# Altium schematic sheet AMU-S12-V00-PROFET.SchDoc
size A3; DocumentNumber: 12; SheetNumber: 12; SheetTotal: 12; Version: 00; Project: ####; PageSetup: Record=PageOptions|CenterHorizontal=True|CenterVertical=True|PrintScale=0.97|XCorrection=1.00|YCorrection=1.00|PrintKind=0|BorderSize=5000000|LeftOffset=0|BottomOffset=0|Orientation=2|PaperLength=1000|PaperWidth=1000|Scale=100|PaperSource=7|PrintQuality=-4|MediaType=1|DitherType=10|PaperKind=A4|PrintScaleMode=1
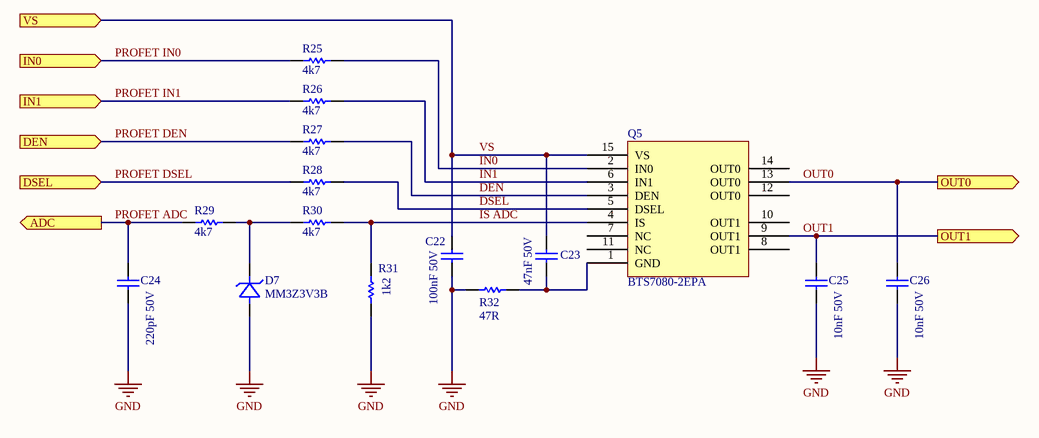
[diagram p0: AMU-S12-V00-PROFET.SchDoc]

## Parts
C22  100nF 50V  [Cap_Ceramic_0603]
C23  47nF 50V  [Cap_Ceramic_0603]
C24  220pF 50V  [Cap_Ceramic_0603]
C25  10nF 50V  [Cap_Ceramic_0603]
C26  10nF 50V  [Cap_Ceramic_0603]
D7  MM3Z3V3B  [SOD-323F]
Q5  BTS7080-2EPA  [BTS7008-2EPZ]
R25  4k7  [Res_ThinFilm_0603]
R26  4k7  [Res_ThinFilm_0603]
R27  4k7  [Res_ThinFilm_0603]
R28  4k7  [Res_ThinFilm_0603]
R29  4k7  [Res_ThinFilm_0603]
R30  4k7  [Res_ThinFilm_0603]
R31  1k2  [Res_ThinFilm_0603]
R32  47R  [Res_ThinFilm_0603]

## Ports
ADC (out), DEN (in), DSEL (in), IN0 (in), IN1 (in), OUT0 (out), OUT1 (out), VS (in)

## Nets
GND: C22.1 C24.1 C25.2 C26.2 D7.1(Anode) R31.1 R32.1
DEN: Q5.3(DEN) R27.2
DSEL: Q5.5(DSEL) R28.2
IN0: Q5.2(IN0) R25.2
IN1: Q5.6(IN1) R26.2
IS ADC: Q5.4(IS) R30.2 R31.2
OUT0: C26.1 Q5.13(OUT0) ; port OUT0
OUT1: C25.1 Q5.9(OUT1) ; port OUT1
PROFET ADC: C24.2 R29.1 ; port ADC
PROFET DEN: R27.1 ; port DEN
PROFET DSEL: R28.1 ; port DSEL
PROFET IN0: R25.1 ; port IN0
PROFET IN1: R26.1 ; port IN1
VS: C22.2 C23.2 Q5.15(VS) ; port VS
NetC23_1: C23.1 Q5.1(GND) R32.2
NetD7_2: D7.2(Cathode) R29.2 R30.1

Not connected (* = marked no-connect by the designer): Q5 7(NC) 8(OUT1) 10(OUT1) 11(NC) 12(OUT0) 14(OUT0)

## Notes on the sheet
- Revision History:
- Sheet Title:
- Rev
- Date
- Description
- Project:
- Size:
- Drawn By:
- A3
- Number:
- Revision:
- Sheet
- Version:
- of
- QUT Motorsport
- O-120, Gardens Point
- 2 George Street
- Brisbane, QLD 4000
- Australia
- Print Date:
- Print Time:
- File Name:

## Library data of the parts
C22 = 100nF 50V 5% X7R 0603: Capacitor, Ceramic, SMD, 100nF, 50V, 5%, X7R, 0603
C23 = 47nF 50V 10% X7R 0603: 0.047µF ±10% 50V Ceramic Capacitor X7R 0603 (1608 Metric); ComponentLink1Description: Digikey; ComponentLink1URL: https://www.digikey.com.au/product-detail/en/kemet/C0603C473K5RACTU/399-7933-1-ND/3471656; ComponentLink2Description: Datasheet; ComponentLink2URL: https://content.kemet.com/datasheets/KEM_C1002_X7R_SMD.pdf
C24 = 220pF 50V 5% 0603: 220pF ±5% 50V Ceramic Capacitor C0G, NP0 0603 (1608 Metric); ComponentLink1Description: Digikey; ComponentLink1URL: https://www.digikey.com.au/product-detail/en/kemet/C0603C221J5GACTU/399-1066-1-ND/411341; ComponentLink2Description: Datasheet; ComponentLink2URL: https://content.kemet.com/datasheets/KEM_C1003_C0G_SMD.pdf
C25 C26 = 10nF 50V 20% X7R 0603: 10000pF ±20% 50V Ceramic Capacitor X7R 0603 (1608 Metric); ComponentLink1Description: Digikey; ComponentLink1URL: https://www.digikey.com.au/product-detail/en/kemet/C0603C103M5RACTU/399-7842-1-ND/3471565; ComponentLink2Description: Datasheet; ComponentLink2URL: https://content.kemet.com/datasheets/KEM_C1002_X7R_SMD.pdf
D7 = MM3Z3V3B: Zener Diode 3.3V 200mW ±2% Surface Mount SOD-323F; Manufacturer: ON Semiconductor; MPN: MM3Z56VB; ComponentLink1Description: Digikey; ComponentLink1URL: https://www.digikey.com.au/product-detail/en/on-semiconductor/MM3Z3V3B/MM3Z3V3BCT-ND/1626881; ComponentLink2Description: Datasheet; ComponentLink2URL: https://www.onsemi.com/pub/Collateral/MM3Z9V1B-D.pdf
R25-R30 = 4k7 5% 0603: Resistor, SMD, 4k7, 0.1W, 5%, 0603
R31 = 1k2 5% 0603: Resistor, SMD, 1k2, 0.1W, 5%, 0603
R32 = 47R 5% 0603: Resistor, SMD, 47R, 0.1W, 5%, 0603
Q5 = BTS7080-2EPA: ComponentLink1Description: Infineon; ComponentLink1URL: https://www.infineon.com/cms/en/product/power/smart-low-side-high-side-switches/high-side-switches/profet-plus-2-12v-automotive-smart-high-side-switch/bts7080-2epa/; ComponentLink2Description: Datasheet; ComponentLink2URL: https://www.infineon.com/dgdl/Infineon-BTS7080-2EPA-DataSheet-v01_06-EN.pdf?fileId=5546d4625e763904015e941bf21e2dbe